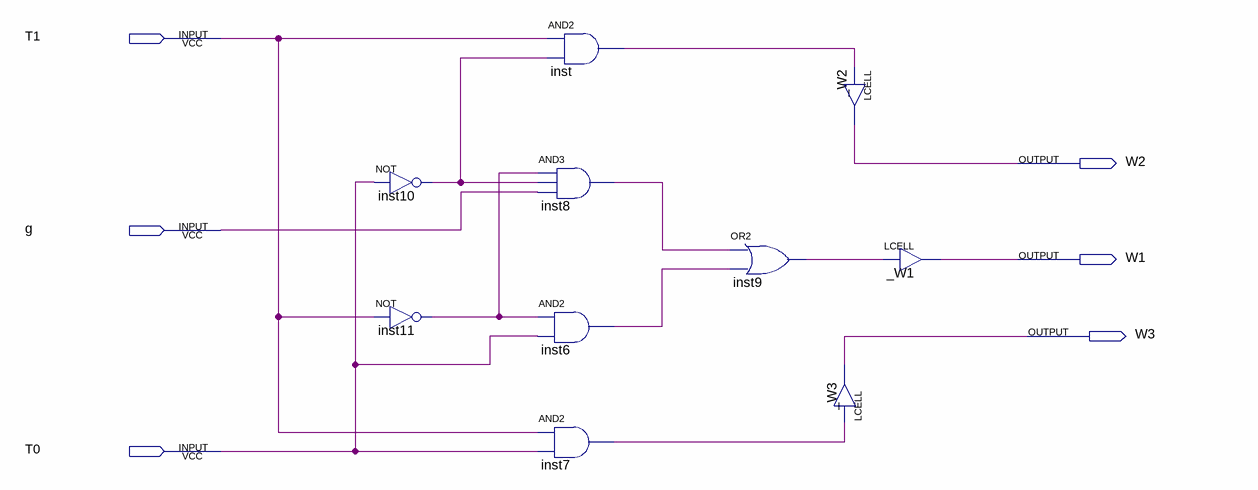
[diagram p0: schematic sheet]
// Quartus schematic ctrlSeq.bdf as structural Verilog: 10 symbols, 6 pins
module ctrlSeq (
  input  T1,
  input  g,
  input  T0,
  output W2,
  output W1,
  output W3
);

  wire inst6_out, inst7_out, inst8_out, inst9_out, inst10_out, inst11_out, inst_out;

  not inst10 (inst10_out, T0);
  not inst11 (inst11_out, T1);
  and inst (inst_out, T1, inst10_out);
  and inst8 (inst8_out, inst11_out, inst10_out, g);
  and inst6 (inst6_out, inst11_out, T0);
  and inst7 (inst7_out, T1, T0);
  or inst9 (inst9_out, inst8_out, inst6_out);
  LCELL _W2 (.IN(inst_out), .OUT(W2));
  LCELL _W3 (.IN(inst7_out), .OUT(W3));
  LCELL _W1 (.IN(inst9_out), .OUT(W1));
endmodule
